# Altium project Encoder Board Hand .PrjPcb
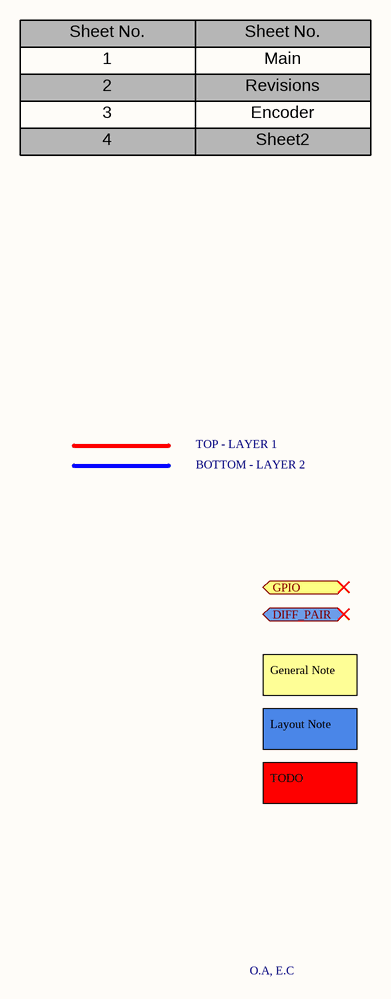
[diagram p0: Main.SchDoc]
3 sheets, 18 parts. Net scope: flat (ports and power ports of the same name join across sheets).
Board file: PCB.PcbDoc
Sheets:
  Main.SchDoc
  Encoder.SchDoc
  Connectors.SchDoc

## Sheet Main.SchDoc: =DocumentName
size A4; SheetNumber: 1; SheetTotal: 4

### Ports
DIFF_PAIR (bidir), GPIO (bidir)

### Notes on the sheet
- Sheet No.
- 1
- Main
- 2
- 3
- 4
- Revisions
- Encoder
- Sheet2
- TOP - LAYER 1
- BOTTOM - LAYER 2
- General Note
- Layout Note
- TODO
- O.A, E.C

## Sheet Encoder.SchDoc
size A4; SheetNumber: 3; SheetTotal: 4
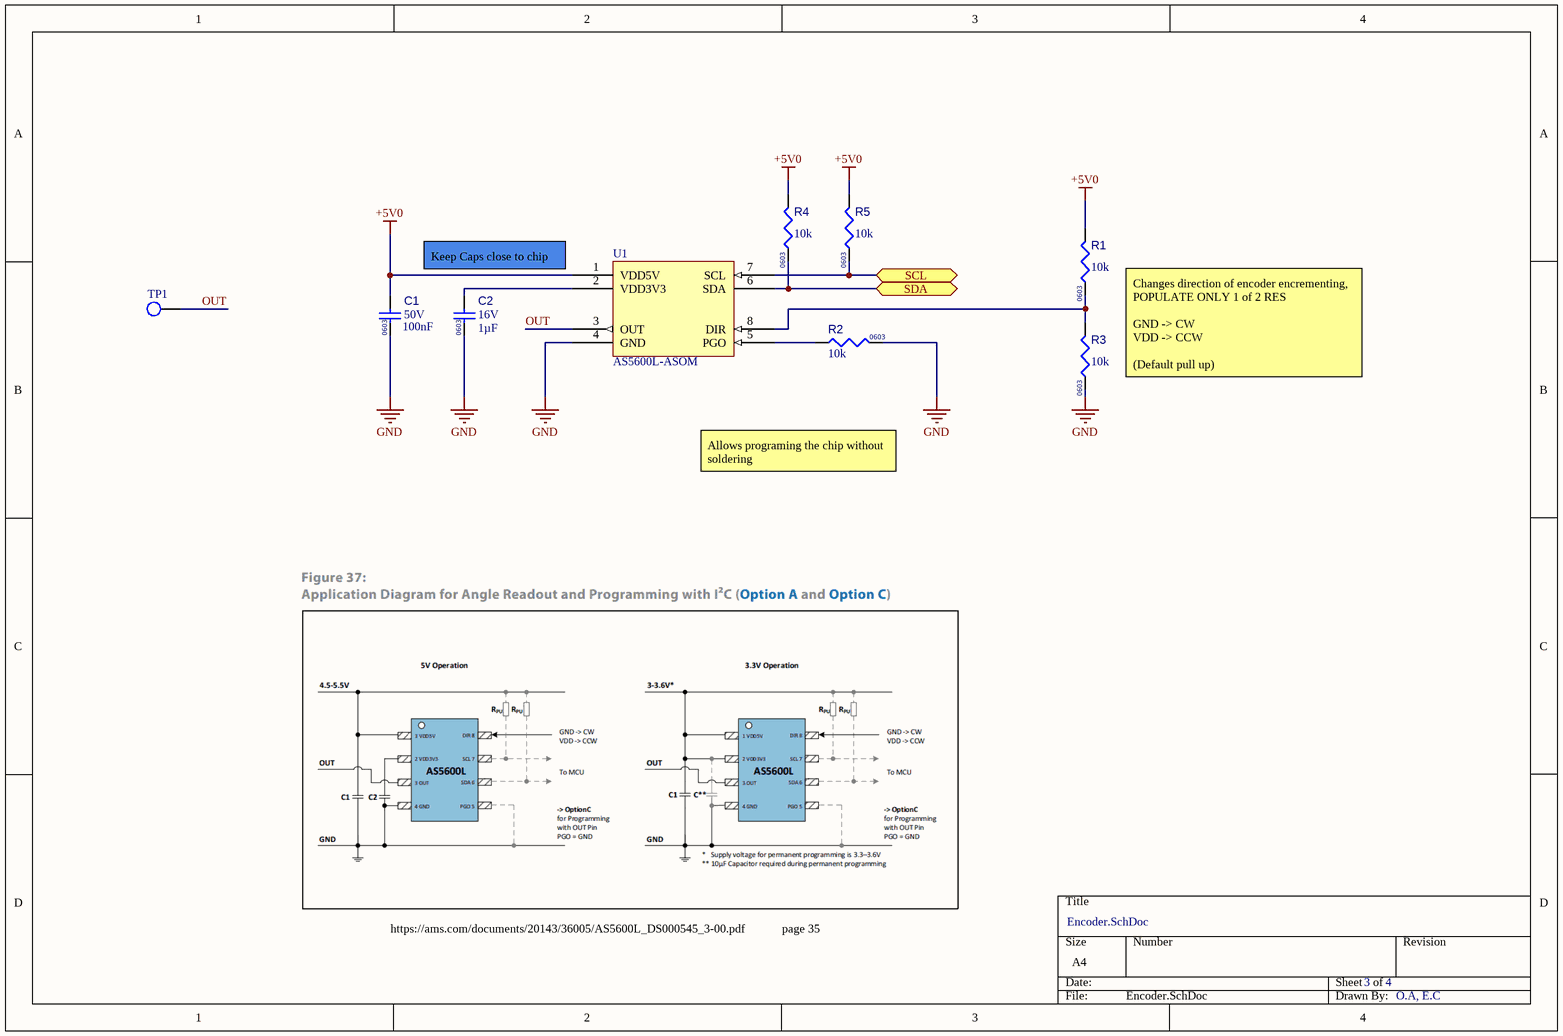
[diagram p1: Encoder.SchDoc]

### Parts
C1  value 100nF  Voltage Rating: 50V  Case/Package: 0603  [CAPC1608X90X40NL10T20]  (hidden comment: Capacitor 100 nF +/-10% 50 V 0603)
C2  value 1µF  Case/Package: 0603  Voltage Rating: 16V  [CAPC1608X90X35NL15T15]  (hidden comment: Capacitor 1uF +/- 10% 16V 0603)
R1  value 10k  Case/Package: 0603  [RESC1608X55X25NL10T15]  (hidden comment: Resistor 10k +/-1% 0603 100 mW)
R2  value 10k  Case/Package: 0603  [RESC1608X55X25NL10T15]  (hidden comment: Resistor 10k +/-1% 0603 100 mW)
R3  value 10k  Case/Package: 0603  [RESC1608X55X25NL10T15]  (hidden comment: Resistor 10k +/-1% 0603 100 mW)
R4  value 10k  Case/Package: 0603  [RESC1608X55X25NL10T15]  (hidden comment: Resistor 10k +/-1% 0603 100 mW)
R5  value 10k  Case/Package: 0603  [RESC1608X55X25NL10T15]  (hidden comment: Resistor 10k +/-1% 0603 100 mW)
TP1  RCUCTE  [FP-S2761-46R-MFG]  (value not drawn)
U1  AS5600L-ASOM  [AS5600L-ASOM-Footprint-1]

### Ports
SCL (bidir), SDA (bidir)

### Nets
+5V0: C1.2 R1.2 R4.2 R5.2 U1.1(VDD5V)
GND: C1.1 C2.1 R2.2 R3.1 U1.4(GND)
OUT: TP1.1 U1.3(OUT)
NetC2_2: C2.2 U1.2(VDD3V3)
NetD3_1: R4.1 U1.6(SDA) ; port SDA
NetD3_2: R5.1 U1.7(SCL) ; port SCL
NetR1_1: R1.1 R3.2 U1.8(DIR)
NetR2_1: R2.1 U1.5(PGO)

### Notes on the sheet
- Keep Caps close to chip
- Changes direction of encoder encrementing, POPULATE ONLY 1 of 2 RES
  GND -> CW
  VDD -> CCW
  (Default pull up)
- Allows programing the chip without soldering
- https://ams.com/documents/20143/36005/AS5600L_DS000545_3-00.pdf
- page 35
- O.A, E.C

### Library data of the parts
C1 = CMP-001-00017-8: Chip Capacitor, 100 nF, +/- 10%, 50 V, 0603 (1608 Metric); Capacitor Type: Ceramic; Tolerance: 10%; Mounting Technology: SM; Max Operating Temperature: 125°C; RoHS Compliant: True; Pins: 2; Min Operating Temperature: -55°C
C2 = CMP-001-00004-8: Chip Capacitor, 1 uF, +/- 10%, 16 V, 0603 (1608 Metric); Capacitor Type: Ceramic; Mounting Technology: SM; RoHS Compliant: True; Min Operating Temperature: -55°C; Pins: 2; Max Operating Temperature: 125°C; Tolerance: 10%
R1-R5 = CMP-009-00017-7: Chip Resistor, 10 KOhm, +/- 1%, 01 W, -55 to 155 degC, 0603 (1608 Metric); Voltage Rating: 50V; Power: 100mW; RoHS Compliant: True; Min Operating Temperature: -55°C; Pins: 2; Mounting Technology: SM; Max Operating Temperature: 155°C; Tolerance: 1%
TP1 = CMP-002-00072-5: Test point; Connector Type: Interconnection Device; Pins: 2; Max Operating Temperature: 125°C; Case/Package: 0603; Mounting Technology: Surface Mount; RoHS Compliant: Yes; Min Operating Temperature: -55°C
U1 = CMP-010-00024-5: AS5600L Series 12-Bit Programmable On-Axis Magnetic Rotary Position Sensor; Min Supply Voltage: 3.3V; Max Supply Voltage: 5V; Min Operating Temperature: -40°C; Pins: 8; Max Operating Temperature: 125°C; Case/Package: SOIC-8; Sensor Type: Magnetic Rotary Position Sensor; Mounting Technology: SMD

## Sheet Connectors.SchDoc
size A4; SheetNumber: 4; SheetTotal: 4
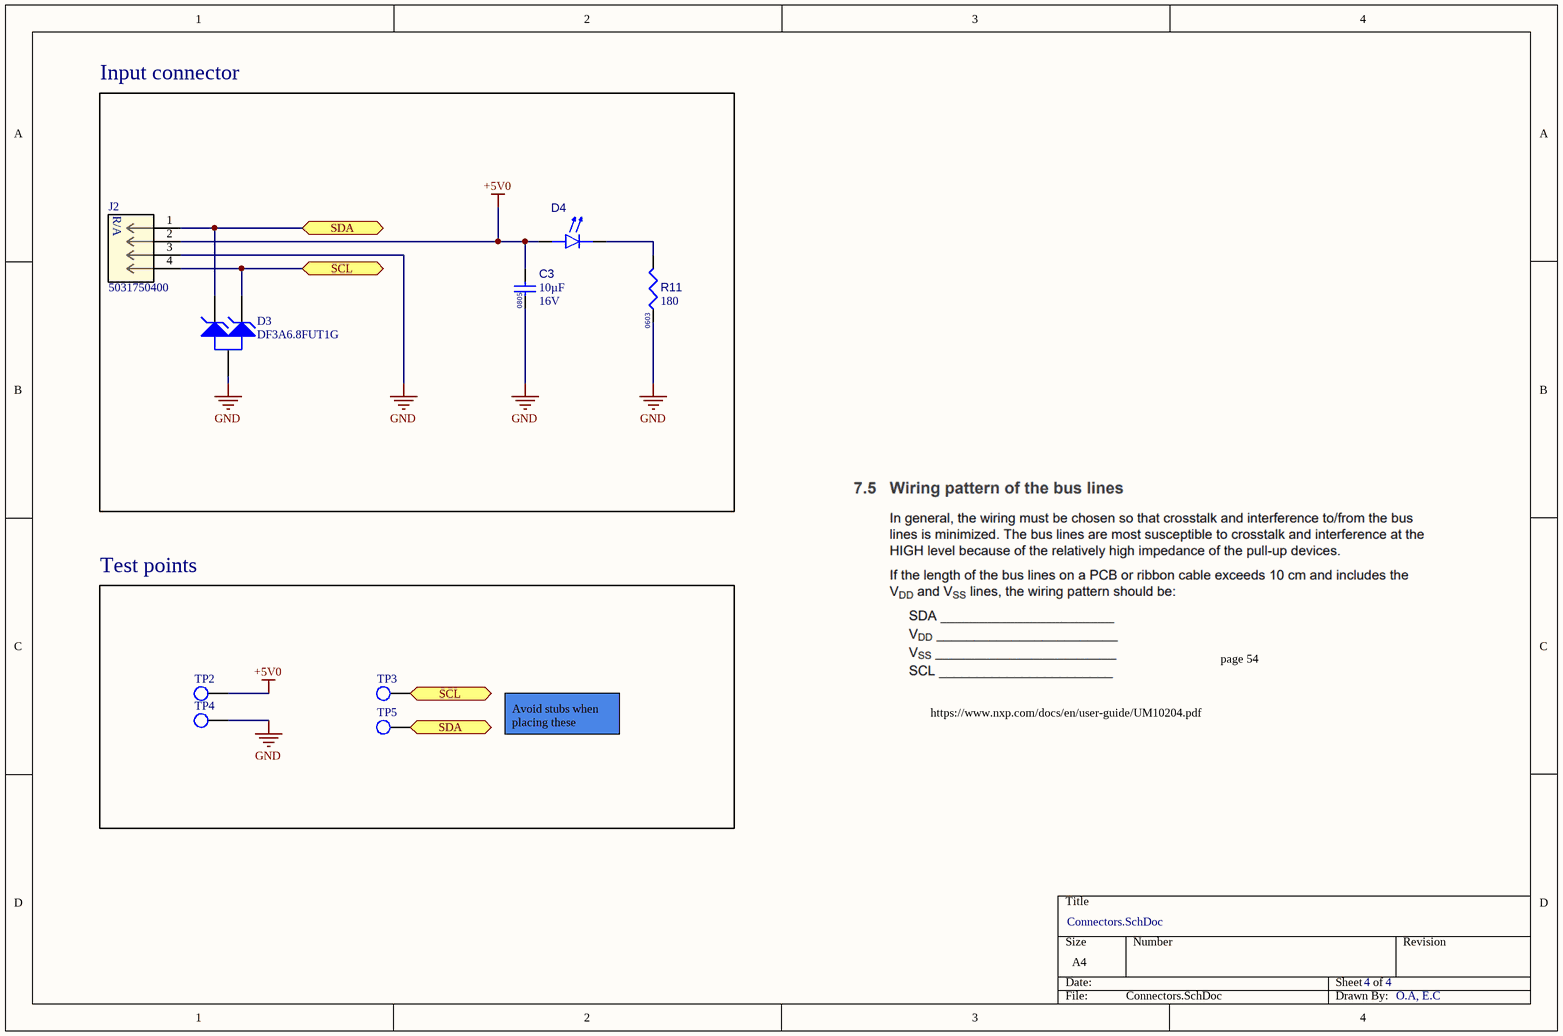
[diagram p2: Connectors.SchDoc]

### Parts
C3  value 10µF  Voltage Rating: 16V  Case/Package: 0805  [CAP CER 10UF 16V X5R 0805-Footprint-1]  (hidden comment: CAP CER 10UF 16V X5R 0805)
D3  DF3A6.8FUT1G  [ONSC-SC-70-3-419-04_V]
D4  150060RS75000  [WL-SMCW_0603_150060xx75000]  (value not drawn)
J2  5031750400  [5031750400-Footprint-1]
R11  value 180  Case/Package: 0603  [RESC0603(1608)_N]  (hidden comment: RC0603JR-07180RL)
TP2  RCUCTE  [FP-S2761-46R-MFG]  (value not drawn)
TP3  RCUCTE  [FP-S2761-46R-MFG]  (value not drawn)
TP4  RCUCTE  [FP-S2761-46R-MFG]  (value not drawn)
TP5  RCUCTE  [FP-S2761-46R-MFG]  (value not drawn)

### Blocks framed on the sheet
Input connector: C3 D3 D4 J2 R11
Test points: TP2-TP5

### Ports
SCL (bidir), SDA (bidir)

### Nets
+5V0: C3.2 D4.2(A) J2.2 TP2.1
GND: C3.1 D3.3(A) J2.3 R11.1 TP4.1
NetD3_1: D3.1(K1) J2.1 TP5.1 ; port SDA
NetD3_2: D3.2(K2) J2.4 TP3.1 ; port SCL
NetD4_1: D4.1(K) R11.2

### Notes on the sheet
- https://www.nxp.com/docs/en/user-guide/UM10204.pdf
- page 54
- Avoid stubs when placing these
- O.A, E.C
- (in symbol CMP-002-00074-2) R/A

### Library data of the parts
C3 = CMP-001-00084-6: Ceramic Capacitor, Multilayer, Ceramic, 16V, 10% +Tol, 10% -Tol, X5R, 15% TC, 10uF, Surface Mount, 0805; Pins: 2; Capacitor Type: Ceramic; Max Operating Temperature: 85°C; Min Operating Temperature: -55°C; RoHS Compliant: Yes; Mounting Technology: Surface Mount
D3 = CMP-004-00039-1: Trans Voltage Suppressor Diode, 150W, Unidirectional, 2 Element, Silicon; Dynamic Impedance-Max: 50R; Time @ Peak Reflow Temperature-Max (s): 40s; Test Current: 5mA; Max Power Dissipation: 200mW; Package Body Material: Plastic; Number of Elements: 2; Voltage Tol-Max: 5.9%; Max Breakdown Voltage: 7.2V; Qualification Status: Not Qualified; Min Breakdown Voltage: 6.4V; Reference Voltage-Nom: 6.8V; Terminal Form: Gull Wing; Reach SVHC Compliant: Yes; Package Shape: Rectangular; Terminal Finish: Tin; Terminal Position: DUAL; JESD-609 Code: e3; Non-rep Peak Rev Power Dis-Max: 150W; Surface Mount: Yes; Diode Type: TRANS VOLTAGE SUPPRESSOR; Technology: ZENER; Polarity: Unidirectional; Max Operating Temperature: 150°C; Moisture Sensitivity Level: 1; Diode Element Material: SILICON; Min Operating Temperature: -55°C; Package Style: SMALL OUTLINEMeter; Pins: 3; Peak Reflow Temperature (Cel): 260°C; JESD-30 Code: R-PDSO-G3; RoHS Compliant: Yes
D4 = CMP-007-00036-1: Single Color LED, Red, Water Clear, 1.1mm; Forward Current: 30mA; Max Operating Temperature: 85°C; Mounting Technology: Surface Mount; RoHS Compliant: Yes; Pins: 2; Min Operating Temperature: -40°C
J2 = CMP-002-00074-2: DIP Connector, 4 Contact(s), 2 Row(s), Female, Right Angle, 0.059 inch Pitch, Solder Terminal, Locking, Beige Insulator, Receptacle; Connector Type: DIP; Min Operating Temperature: -85°C; Mounting Technology: Board; RoHS Compliant: Yes; Max Operating Temperature: 85°C
R11 = CMP-009-00178-1: Fixed Resistor, Metal Glaze/thick Film, 0.1W, 180ohm, 75V, 5% +/-Tol, 100ppm/Cel, Surface Mount, 0603; Power: 100mW; Tolerance: 5%; Pins: 2; Mounting Technology: Surface Mount; RoHS Compliant: Yes; Max Operating Temperature: 155°C; Min Operating Temperature: -55°C
TP2-TP5 = CMP-002-00072-5: as TP1 on sheet Encoder; Pins: 2; Max Operating Temperature: 125°C; Case/Package: 0603; Mounting Technology: Surface Mount; RoHS Compliant: Yes; Min Operating Temperature: -55°C

## Nets that join several sheets
+5V0: Encoder (5 pins), Connectors (C3.2 D4.2 J2.2 TP2.1)
GND: Encoder (5 pins), Connectors (5 pins)
NetD3_1: Encoder (R4.1 U1.6), Connectors (D3.1 J2.1 TP5.1)
NetD3_2: Encoder (R5.1 U1.7), Connectors (D3.2 J2.4 TP3.1)

## Assembly variants
REV_A: not fitted R4 R7 R8 R9 R10 R? R? R? U2